# Altium schematic sheet NNLightSwitcher_power.SchDoc
size A3
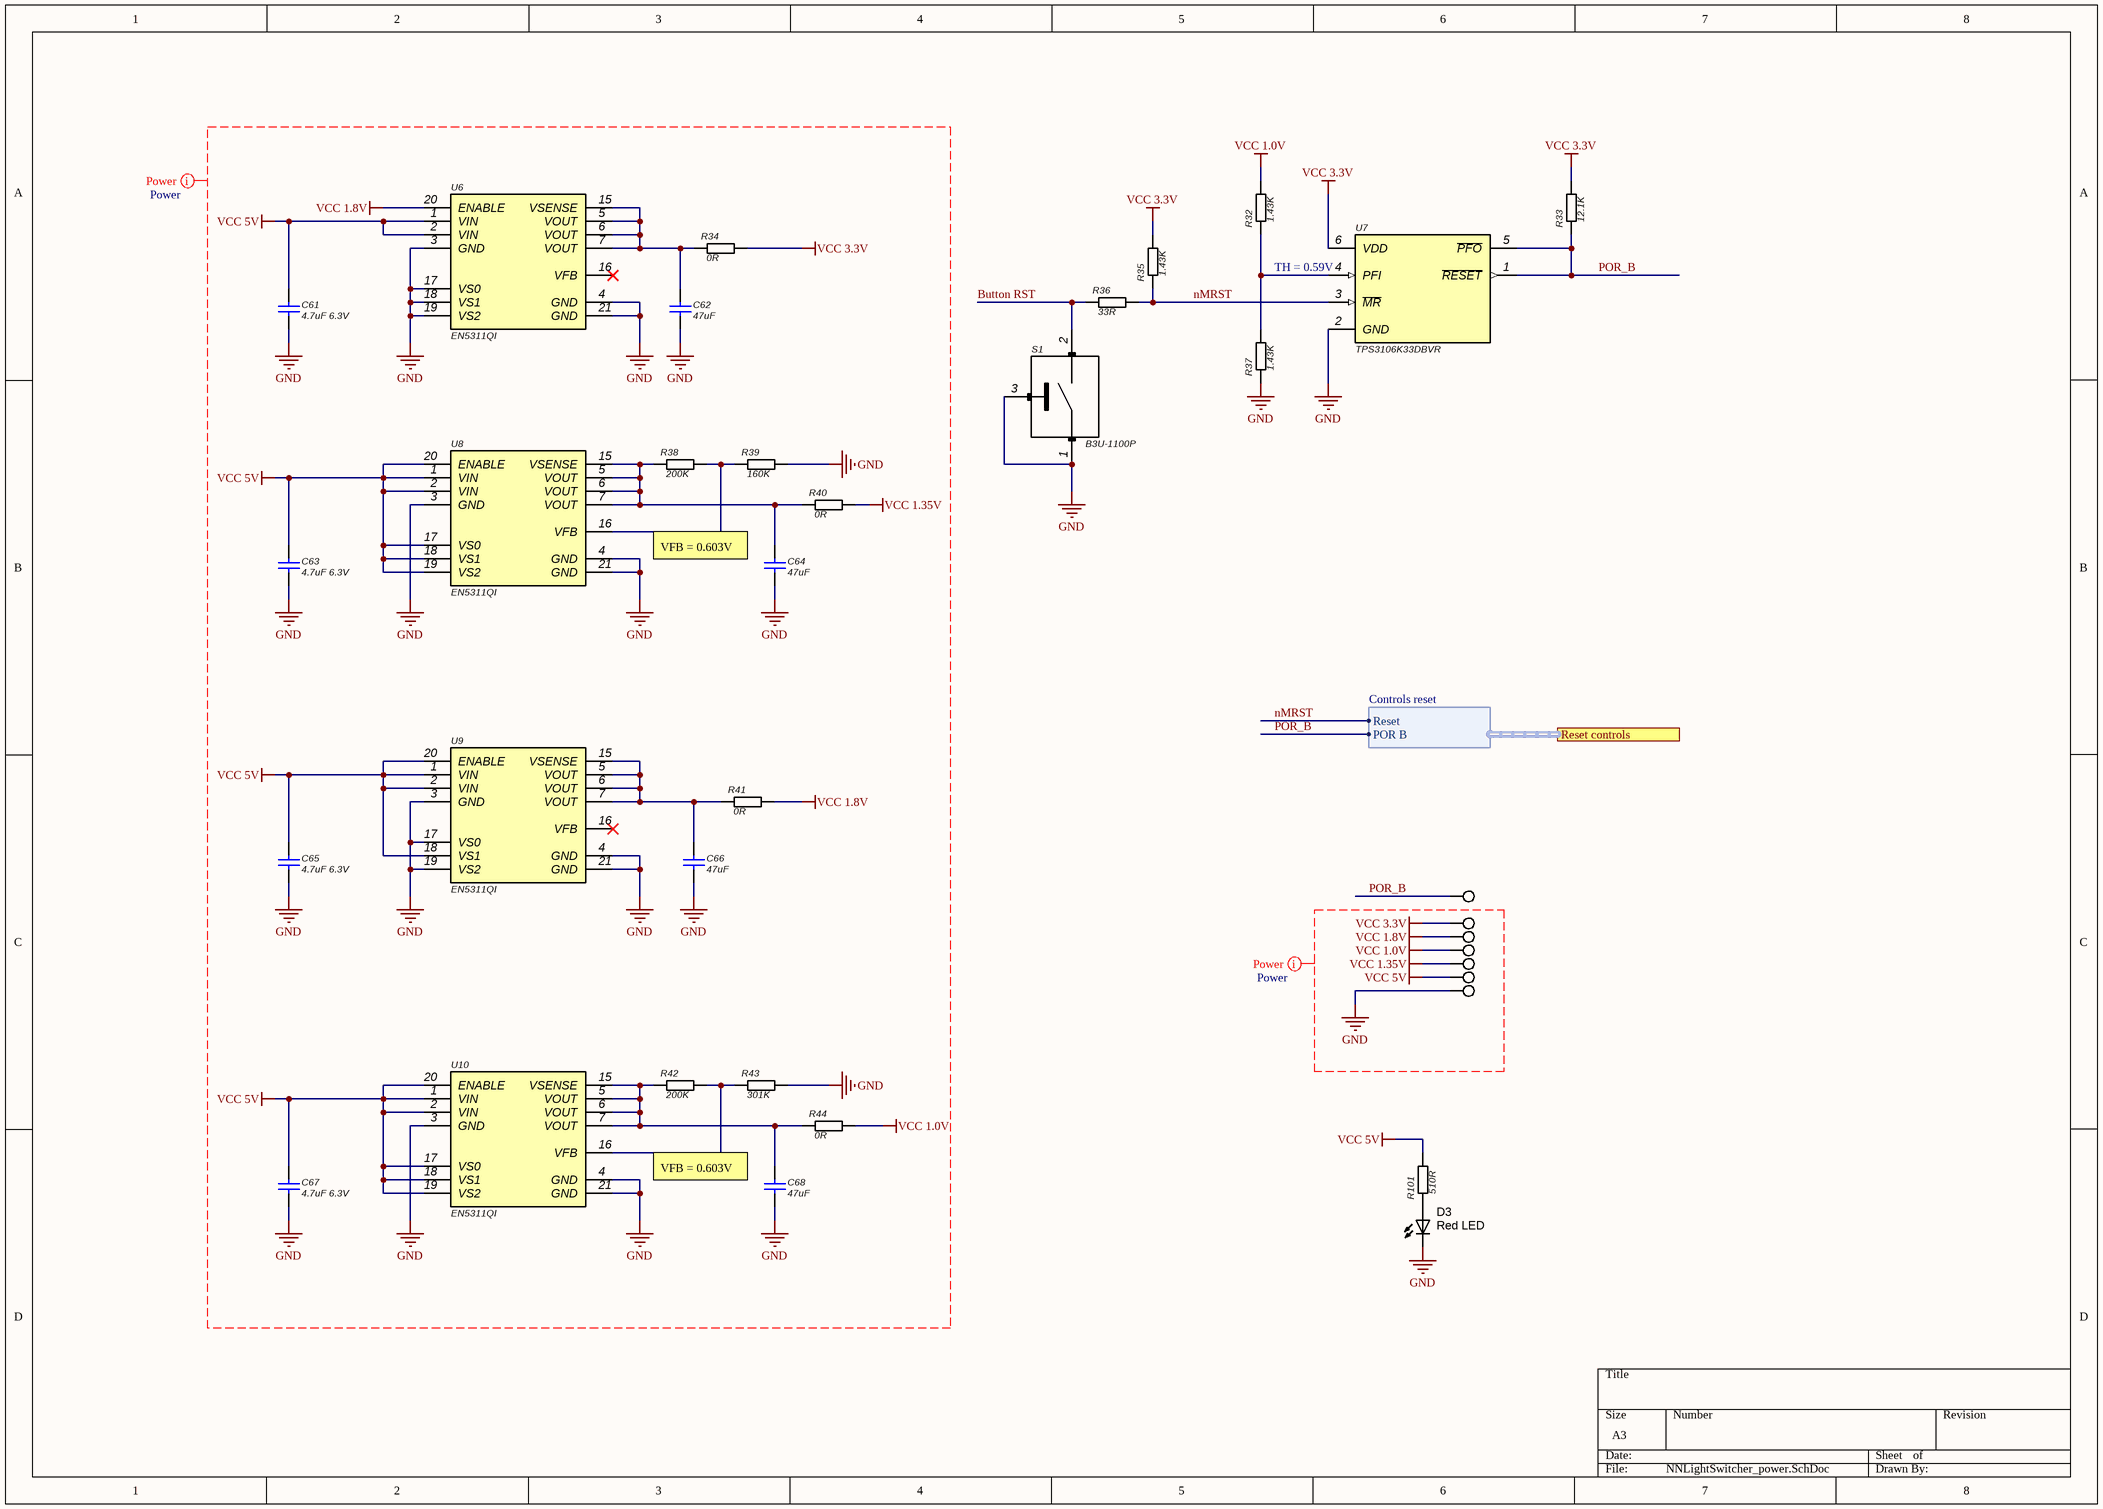
[diagram p0: NNLightSwitcher_power.SchDoc]

## Parts
C61  4.7uF 6.3V  [*0603]
C62  47uF  [Res_0805]
C63  4.7uF 6.3V  [*0603]
C64  47uF  [Res_0805]
C65  4.7uF 6.3V  [*0603]
C66  47uF  [Res_0805]
C67  4.7uF 6.3V  [*0603]
C68  47uF  [Res_0805]
D3  Red LED  [*LED_SML-P11UTT86R_SML-P11MTT86(Primary)]
R32  1.43K  [0402]
R33  12.1K  [0402]
R34  0R  [0402]
R35  1.43K  [0402]
R36  33R  [0402]
R37  1.43K  [0402]
R38  200K  [0402]
R39  160K  [0402]
R40  0R  [0402]
R41  0R  [0402]
R42  200K  [0402]
R43  301K  [0402]
R44  0R  [0402]
R101  510R  [0402]
S1  B3U-1100P  [*SW_B3U-1100P]
TP7  Test point  [Testpoint_Keystone_Miniature]  (value not drawn)
TP8  Test point  [Testpoint_with_pad]  (value not drawn)
TP9  Test point  [Testpoint_with_pad]  (value not drawn)
TP10  Test point  [Testpoint_with_pad]  (value not drawn)
TP11  Test point  [Testpoint_Keystone_Miniature]  (value not drawn)
TP12  Test point  [Testpoint_with_pad]  (value not drawn)
TP13  Test point  [Testpoint_with_pad]  (value not drawn)
U6  EN5311QI  [*QFN_20-PIN_ATMEL_20M1]
U7  TPS3106K33DBVR  [*SOT95P280X145-6N]
U8  EN5311QI  [*QFN_20-PIN_ATMEL_20M1]
U9  EN5311QI  [*QFN_20-PIN_ATMEL_20M1]
U10  EN5311QI  [*QFN_20-PIN_ATMEL_20M1]

## Ports
Reset controls (harness Controls reset)

## Harnesses
Controls reset: POR B, Reset

## Nets
GND: C61.2 C62.2 C63.2 C64.2 C65.2 C66.2 C67.2 C68.2 D3.C R37.1 R39.2 R43.2 S1.1 S1.3 TP13.1 U6.3(GND) U6.4(GND) U6.17(VS0) U6.18(VS1) U6.19(VS2) U6.21(GND) U7.2(GND) U8.3(GND) U8.4(GND) U8.21(GND) U9.3(GND) U9.4(GND) U9.17(VS0) U9.19(VS2) U9.21(GND) U10.3(GND) U10.4(GND) U10.21(GND)
VCC 1.0V: R32.2 R44.2 TP10.1
VCC 1.8V: R41.2 TP9.1 U6.20(ENABLE)
VCC 1.35V: R40.2 TP11.1
VCC 3.3V: R33.2 R34.2 R35.2 TP8.1 U7.6(VDD)
VCC 5V: C61.1 C63.1 C65.1 C67.1 R101.2 TP12.1 U6.1(VIN) U6.2(VIN) U8.1(VIN) U8.2(VIN) U8.17(VS0) U8.18(VS1) U8.19(VS2) U8.20(ENABLE) U9.1(VIN) U9.2(VIN) U9.18(VS1) U9.20(ENABLE) U10.1(VIN) U10.2(VIN) U10.17(VS0) U10.18(VS1) U10.19(VS2) U10.20(ENABLE)
Button RST: R36.1 S1.2
nMRST: R35.1 R36.2 U7.3(~{MR}) ; port Reset controls.Reset
POR_B: R33.1 TP7.1 U7.1(~{RESET}) U7.5(~{PFO}) ; port Reset controls.POR B
NetC62_1: C62.1 R34.1 U6.5(VOUT) U6.6(VOUT) U6.7(VOUT) U6.15(VSENSE)
NetC64_1: C64.1 R38.1 R40.1 U8.5(VOUT) U8.6(VOUT) U8.7(VOUT) U8.15(VSENSE)
NetC66_1: C66.1 R41.1 U9.5(VOUT) U9.6(VOUT) U9.7(VOUT) U9.15(VSENSE)
NetC68_1: C68.1 R42.1 R44.1 U10.5(VOUT) U10.6(VOUT) U10.7(VOUT) U10.15(VSENSE)
NetD3_A: D3.A R101.1
NetR32_1: R32.1 R37.2 U7.4(PFI)
NetR38_2: R38.2 R39.1 U8.16(VFB)
NetR42_2: R42.2 R43.1 U10.16(VFB)

Not connected (* = marked no-connect by the designer): U6 16(VFB)*; U9 16(VFB)*

## Layout directives
net class Power: GND, VCC 1.0V, VCC 1.8V, VCC 1.35V, VCC 3.3V, VCC 5V

## Notes on the sheet
- (near U7) TH = 0.59V
- (near C64) VFB = 0.603V
- (near C68) VFB = 0.603V

## Library data of the parts
C61 C63 C65 C67 = Capacitor 4.7uF 6.3V: ComponentLink1Description: Datasheet link; ComponentLink1URL: http://www.yageo.com/documents/recent/UPY-GP_NP0_16V-to-50V_16.pdf
C62 C64 C66 C68 = Capacitor 47uF: ComponentLink1Description: Datasheet link; ComponentLink1URL: http://www.yageo.com/documents/recent/UPY-GP_NP0_16V-to-50V_16.pdf
D3 = APHHS1005SURCK: LED red 0402; Manufacturer 1: Kingbright; Lens Color: Clear; Forward Current: 20mA; Forward Voltage: 1.95V; Luminous Intensity: 220mcd; Viewing Angle: 120°; Lens Style: Clear,Flat; Dominant Wavelength: 630nm; Number of LEDs: 1; Wavelength: 635nm; ComponentLink1URL: https://datasheet.ciiva.com/15198/getdatasheetpartid-569583-15198505.pdf?src-supplier=Verical; ComponentLink1Description: https://datasheet.ciiva.com/15198/getdatasheetpartid-569583-15198505.pdf?src-supplier=Verical; Supplier 1: Digi-Key; Manufacturer Part Number 1: APHHS1005SURCK; Stock 1: 30423; Pricing 1: 1=0,42000, 10=0,30400, 100=0,19820, 500=0,14248, 1000=0,11151 (USD); RoHS: Yes; Mount: Surface Mount; Case/Package: 0402; Number of Pins: 2; Color: Red; Case Code (Metric): 1005; Case Code (Imperial): 0402; Min Operating Temperature: -40°C; Max Operating Temperature: 85°C; Illumination Color: Red; Packaging: Tape and Reel; Package Quantity: 2000; Test Current: 20mA; Length: 1mm; Height: 0.6mm; Width: 0.5mm; Lead Free: Lead Free; ComponentLink2URL: https://datasheet.ciiva.com/2114/aphhs1005surck-2114140.pdf?src-supplier=Digi-Key; ComponentLink2Description: https://datasheet.ciiva.com/2114/aphhs1005surck-2114140.pdf?src-supplier=Digi-Key; ComponentLink3URL: https://datasheet.ciiva.com/4689/aphhs1005surck-32322-4689068.pdf?src-supplier=Mouser; ComponentLink3Description: https://datasheet.ciiva.com/4689/aphhs1005surck-32322-4689068.pdf?src-supplier=Mouser; ComponentLink4URL: https://datasheet.ciiva.com/14603/70062833-14603899.pdf?src-supplier=Allied+Electronics; ComponentLink4Description: https://datasheet.ciiva.com/14603/70062833-14603899.pdf?src-supplier=Allied+Electronics; ComponentLink5URL: https://datasheet.ciiva.com/2114/aphhs1005surck-2114141.pdf?src-supplier=Digi-Key; ComponentLink5Description: https://datasheet.ciiva.com/2114/aphhs1005surck-2114141.pdf?src-supplier=Digi-Key; ComponentLink6URL: https://datasheet.ciiva.com/2114/aphhs1005surck-2114142.pdf?src-supplier=Digi-Key; ComponentLink6Description: https://datasheet.ciiva.com/2114/aphhs1005surck-2114142.pdf?src-supplier=Digi-Key
R32 R35 R37 = Resistor 1.43K
R33 = Resistor 12.1K
R34 R40 R41 R44 = Resistor 0R
R36 = Resistor 33R
R38 R42 = Resistor 200K
R39 = Resistor 160K
R43 = Resistor 301K
R101 = Resistor 510R
S1 = B3U-1100P: Switch Tactile N.O. SPST Projected Plunger PC Pins 0.05A 24VDC 1.47N Thru-Hole Bag; Manufacturer 1: Omron; Actuator Length: 0.4mm; Actuator Type: Standard; Contact Current Rating: 50mA; Contact Resistance: 100mR; Electrical Life: 200000Cycles; Illumination Type: Non-Illuminated,Illuminated; Max Voltage Rating (DC): 12V; Operating Force: 1.5N; Ratings: Dust Proof; Switch Function: Off-Mom; Switch Travel: 0.15mm; Value: *; ComponentLink1Description: https://datasheet.ciiva.com/1634/60838-1634404.pdf?src-supplier=Farnell; ComponentLink1URL: https://datasheet.ciiva.com/1634/60838-1634404.pdf?src-supplier=Farnell; ComponentLink2Description: https://datasheet.ciiva.com/30197/en-b3u-30197271.pdf?src-supplier=Onlinecomponents.com; ComponentLink2URL: https://datasheet.ciiva.com/30197/en-b3u-30197271.pdf?src-supplier=Onlinecomponents.com; ComponentLink3Description: https://datasheet.ciiva.com/22696/60838-22696216.pdf?src-supplier=Element14; ComponentLink3URL: https://datasheet.ciiva.com/22696/60838-22696216.pdf?src-supplier=Element14; ComponentLink4Description: https://datasheet.ciiva.com/2901/b3u-1110-2901097.pdf?src-supplier=Digi-Key; ComponentLink4URL: https://datasheet.ciiva.com/2901/b3u-1110-2901097.pdf?src-supplier=Digi-Key; ComponentLink5Description: https://datasheet.ciiva.com/2901/b3u-1110-2901098.pdf?src-supplier=Digi-Key; ComponentLink5URL: https://datasheet.ciiva.com/2901/b3u-1110-2901098.pdf?src-supplier=Digi-Key; ComponentLink6Description: https://datasheet.ciiva.com/2901/b3u-1110-2901099.pdf?src-supplier=Digi-Key; ComponentLink6URL: https://datasheet.ciiva.com/2901/b3u-1110-2901099.pdf?src-supplier=Digi-Key; ComponentLink7Description: https://datasheet.ciiva.com/1532/60838-1532684.pdf?src-supplier=Element14; ComponentLink7URL: https://datasheet.ciiva.com/1532/60838-1532684.pdf?src-supplier=Element14; ComponentLink8Description: https://datasheet.ciiva.com/14142/b3u-eng-datasheet-14142541.pdf?src-supplier=Distrelec; ComponentLink8URL: https://datasheet.ciiva.com/14142/b3u-eng-datasheet-14142541.pdf?src-supplier=Distrelec; ComponentLink9Description: https://datasheet.ciiva.com/16155/en-b3u-16155023.pdf?src-supplier=Onlinecomponents.com; ComponentLink9URL: https://datasheet.ciiva.com/16155/en-b3u-16155023.pdf?src-supplier=Onlinecomponents.com; Contact Plating: Silver; Current Rating: 50mA; Depth: 4mm; Lead Free: Lead Free; Length: 3.15mm; Manufacturer Part Number 1: B3U-1100P; Max Current Rating: 50mA; Max Operating Temperature: 70°C; Mechanical Life: 200000Cycles; Min Operating Temperature: -25°C; Mount: Surface Mount; Orientation: Straight; Package Quantity: 1; Packaging: Tape and Reel; Pricing 1: 1=1,00000, 10=0,96100, 25=0,90700, 50=0,79800, 100=0,72600, 250=0,68900, 500=0,61000, 1000=0,52600, 3500=0,51500, 10000=0,51500 (USD); REACH SVHC: Unknown; RoHS: Yes; Stock 1: 10341; Supplier 1: Mouser; Supplier Part Number 1: 653-B3U-1100P; Termination: SMD/SMT; Throw Configuration: SPST; Voltage Rating (DC): 12V; Weight: 0.022g
TP7-TP13 = Test point: Test Point, Miniature, SMT; ComponentLink1Description: Datasheet URL; ComponentLink1URL: http://www.keyelco.com/userAssets/store/files/5015.PDF
U6 U8-U10 = EN5311QI: 1A DC-DC Step-Down Converter; Manufacturer 1: Intel Altera; Efficiency: 95%; Max Input Voltage: 6.6V; Max Output Voltage: 4.9V; Max Power Dissipation: 6W; Min Input Voltage: 2.4V; Min Output Voltage: 600mV; Number of Outputs: 1; Operating Supply Current: 750nA; Output Type: Adjustable; Output Voltage: 6V; Switching Frequency: 4MHz; ComponentLink1Description: Datasheet URL; ComponentLink1URL: https://sps06.itg.ti.com/sites/KMS/crossdivteams/altium/docs/ComponentDatasheets/DPX165950DT-8148A1.pdf; RoHS: Yes; Supplier 1: Mouser; Supplier Part Number 1: 884-EN5311QI; Case/Package: QFN; ComponentLink2Description: https://datasheet.ciiva.com/1162/1525802-1162514.pdf?src-supplier=Element14; ComponentLink2URL: https://datasheet.ciiva.com/1162/1525802-1162514.pdf?src-supplier=Element14; ComponentLink3Description: https://datasheet.ciiva.com/26927/getdatasheetpartid-755172-26927834.pdf?src-supplier=Verical; ComponentLink3URL: https://datasheet.ciiva.com/26927/getdatasheetpartid-755172-26927834.pdf?src-supplier=Verical; ComponentLink4Description: https://datasheet.ciiva.com/29378/en5311qi-03799-29378571.pdf?src-supplier=Digi-Key; ComponentLink4URL: https://datasheet.ciiva.com/29378/en5311qi-03799-29378571.pdf?src-supplier=Digi-Key; ComponentLink5Description: https://datasheet.ciiva.com/29378/en5311qi-03799-29378573.pdf?src-supplier=Digi-Key; ComponentLink5URL: https://datasheet.ciiva.com/29378/en5311qi-03799-29378573.pdf?src-supplier=Digi-Key; Features: UVLO,OCP,OTP,SCP; Height: 0.04inch; Length: 0.2inch; Manufacturer Part Number 1: EN5311QI; Max Operating Temperature: 85°C; Max Output Current: 1A; Min Operating Temperature: -40°C; Min Supply Voltage: 2.4V; Mount: Surface Mount; Number of Pins: 20; Output Current: 1A; Package Quantity: 1; Packaging: Cut Tape; Radiation Hardening: No; REACH SVHC: No SVHC; Stock 1: 0; Voltage - Output 1: 6V; Weight: 0.002751oz; Width: 0.16inch
U7 = TPS3106K33DBVR: Ultra Low-Supply Current/Supply-Voltage Supervisory Circuits 6-SOT-23 -40 to 85; MF: Texas Instruments; MP: TPS3106K33DBVR; Package: SOT-23-6 Texas Instruments; Price: None; Availability: Unavailable; SnapEDA_Link: https://www.snapeda.com/parts/TPS3106K33DBVR/Texas%20Instruments/view-part/?ref=snap; Value: *